# EAGLE design Primary_Board (EAGLE 9.3.2)
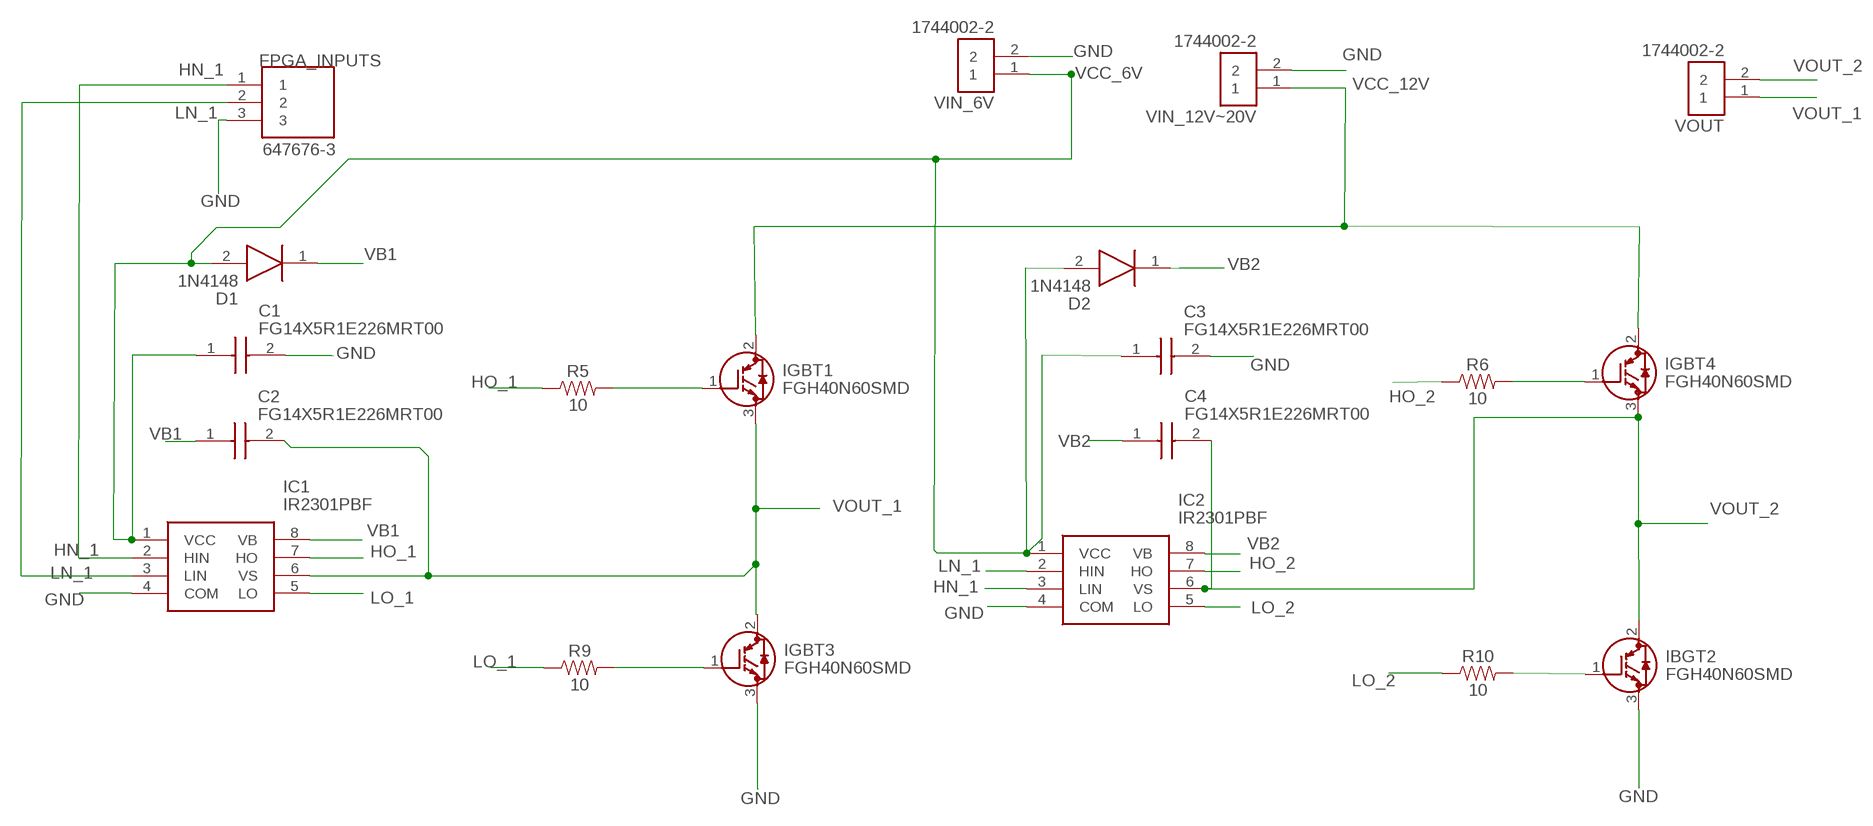
[diagram p0: schematic, sheet 1]

## Parts
C1  FG14X5R1E226MRT00  [CAPPRD550W50D395H550]
C2  FG14X5R1E226MRT00  [CAPPRD550W50D395H550]
C3  FG14X5R1E226MRT00  [CAPPRD550W50D395H550]
C4  FG14X5R1E226MRT00  [CAPPRD550W50D395H550]
D1  1N4148  [DIOAD1068W53L380D172]
D2  1N4148  [DIOAD1068W53L380D172]
FPGA_INPUTS  647676-3  [TE_647676-3]
IBGT2  FGH40N60SMD  [TO556P482X1562X2475-3P]
IC1  IR2301PBF  [DIP762W56P254L988H533Q8N]
IC2  IR2301PBF  [DIP762W56P254L988H533Q8N]
IGBT1  FGH40N60SMD  [TO556P482X1562X2475-3P]
IGBT3  FGH40N60SMD  [TO556P482X1562X2475-3P]
IGBT4  FGH40N60SMD  [TO556P482X1562X2475-3P]
R5  10  10OHM-HORIZ-1/4W-1%  [AXIAL-0.3]
R6  10  10OHM-HORIZ-1/4W-1%  [AXIAL-0.3]
R9  10  10OHM-HORIZ-1/4W-1%  [AXIAL-0.3]
R10  10  10OHM-HORIZ-1/4W-1%  [AXIAL-0.3]
VIN_6V  1744002-2  [CONN_1744002-2]
VIN_12V~20V  1744002-2  [CONN_1744002-2]
VOUT  1744002-2  [CONN_1744002-2]

## Nets
GND: C1.2(-) C3.2(-) FPGA_INPUTS.3 IBGT2.3(E) IC1.4(COM) IC2.4(COM) IGBT3.3(E) VIN_6V.2 VIN_12V~20V.2
HN_1: FPGA_INPUTS.1 IC1.2(HIN) IC2.3(LIN)
HO_1: IC1.7(HO) R5.P$1
HO_2: IC2.7(HO) R6.P$1
IGBT2: IBGT2.1(G) R10.P$2
LN_1: FPGA_INPUTS.2 IC1.3(LIN) IC2.2(HIN)
LO_1: IC1.5(LO) R9.P$1
LO_2: IC2.5(LO) R10.P$1
N$1: IGBT1.1(G) R5.P$2
N$2: IGBT4.1(G) R6.P$2
N$3: IGBT3.1(G) R9.P$2
VB1: C2.1(+) D1.1(K) IC1.8(VB)
VB2: C4.1(+) D2.1(K) IC2.8(VB)
VCC_6V: C1.1(+) C3.1(+) D1.2(A) D2.2(A) IC1.1(VCC) IC2.1(VCC) VIN_6V.1
VCC_12V: IGBT1.2(C) IGBT4.2(C) VIN_12V~20V.1
VOUT_1: C2.2(-) IC1.6(VS) IGBT1.3(E) IGBT3.2(C) VOUT.1
VOUT_2: C4.2(-) IBGT2.2(C) IC2.6(VS) IGBT4.3(E) VOUT.2

## Library data of the parts
C1-C4 = FG14X5R1E226MRT00:FG14X5R1E226MRT00: Multilayer Ceramic Capacitors MLCC - Leaded RAD 25V 22uF X5R 20% LS:2.5mm Source: Datasheet <https://mouser.componentsearchengine.com/Datasheets/1/FG14X5R1E226MRT00.pdf>; DESCRIPTION: Multilayer Ceramic Capacitors MLCC - Leaded RAD 25V 22uF X5R 20% LS:2.5mm; HEIGHT: 5.5mm; MANUFACTURER_NAME: TDK; MANUFACTURER_PART_NUMBER: FG14X5R1E226MRT00
D1 D2 = 1N4148:1N4148: 1N4148, Signal Diode, 400mA 100V, 2-Pin DO-35 Source: Datasheet <http://docs-emea.rs-online.com/webdocs/0d1d/0900766b80d1d11f.pdf>; DESCRIPTION: 1N4148, Signal Diode, 400mA 100V, 2-Pin DO-35; HEIGHT: mm; MANUFACTURER_NAME: Fairchild Semiconductor; MANUFACTURER_PART_NUMBER: 1N4148; MOUSER_PART_NUMBER: 512-1N4148; MOUSER_PRICE-STOCK: https://www.mouser.com/Search/Refine.aspx?Keyword=512-1N4148; RS_PART_NUMBER: 1698781; RS_PRICE-STOCK: http://uk.rs-online.com/web/p/products/1698781
FPGA_INPUTS = 647676-3:647676-3: 3.96 EP HDR ASSY 3P R/A; AVAILABILITY: Unavailable; CENTERLINE_PITCH: 3.96 mm[.156 in]; COMMENT: 647676-3; DESCRIPTION: 3.96 EP HDR ASSY 3P R/A; EU_ROHS_COMPLIANCE: Compliant; MF: TE Connectivity; MP: 647676-3; NUMBER_OF_POSITIONS: 3; PACKAGE: None; PRICE: None; PRODUCT_TYPE: Header; TE_PURCHASE_URL: https://www.te.com/usa-en/product-647676-3.html?te_bu=Cor&te_type=disp&te_campaign=seda_glo_cor-seda-global-disp-prtnr-fy19-seda-model-bom-cta_sma-317_1&elqCampaignId=32493
IBGT2 IGBT1 IGBT3 IGBT4 = FGH40N60SMD:FGH40N60SMD: 600V, 40A, 1.9V, TO-247 Field Stop IGBT Source: Datasheet <http://www.onsemi.com/pub/Collateral/FGH40N60SMD-D.PDF>; DESCRIPTION: 600V, 40A, 1.9V, TO-247 Field Stop IGBT; HEIGHT: 4.82mm; MANUFACTURER_NAME: ON Semiconductor; MANUFACTURER_PART_NUMBER: FGH40N60SMD; MOUSER_PART_NUMBER: 512-FGH40N60SMD; RS_PART_NUMBER: 1241336; RS_PRICE-STOCK: http://uk.rs-online.com/web/p/products/1241336
IC1 IC2 = IR2301PBF:IR2301PBF: High&Low Side MOSFET Driver 350mA PDIP8 Infineon IR2301PBF, Dual MOSFET Power Driver 350mA, 5 20 V, Non-Inverting, 8-Pin PDIP Source: Datasheet <https://www.infineon.com/dgdl/ir2301.pdf?fileId=5546d462533600a4015355c97bb216dc>; ALLIED_NUMBER: 70018142; ALLIED_PRICE-STOCK: https://www.alliedelec.com/infineon-ir2301pbf/70018142/; DESCRIPTION: High&Low Side MOSFET Driver 350mA PDIP8 Infineon IR2301PBF, Dual MOSFET Power Driver 350mA, 5 20 V, Non-Inverting, 8-Pin PDIP; HEIGHT: 5.33mm; MANUFACTURER_NAME: Infineon; MANUFACTURER_PART_NUMBER: IR2301PBF; MOUSER_PART_NUMBER: 942-IR2301PBF; MOUSER_PRICE-STOCK: https://www.mouser.com/Search/Refine.aspx?Keyword=942-IR2301PBF; RS_PART_NUMBER: 8655724P; RS_PRICE-STOCK: http://uk.rs-online.com/web/p/products/8655724P
R5 R6 R9 R10 = SparkFun-Resistors:10OHM: 10Ω resistor A resistor is a passive two-terminal electrical component that implements electrical resistance as a circuit element. Resistors act to reduce current flow, and, at the same time, act to lower voltage levels within circuits. - Wikipedia; PROD_ID: RES-12180
VIN_6V VIN_12V~20V VOUT = 1744002-2:1744002-2: CONN HEADER VERT 2POS 3.96MM; AVAILABILITY: Unavailable; DESCRIPTION: CONN HEADER VERT 2POS 3.96MM; MF: TE Connectivity; MP: 1744002-2; PACKAGE: None; PRICE: None

## Board
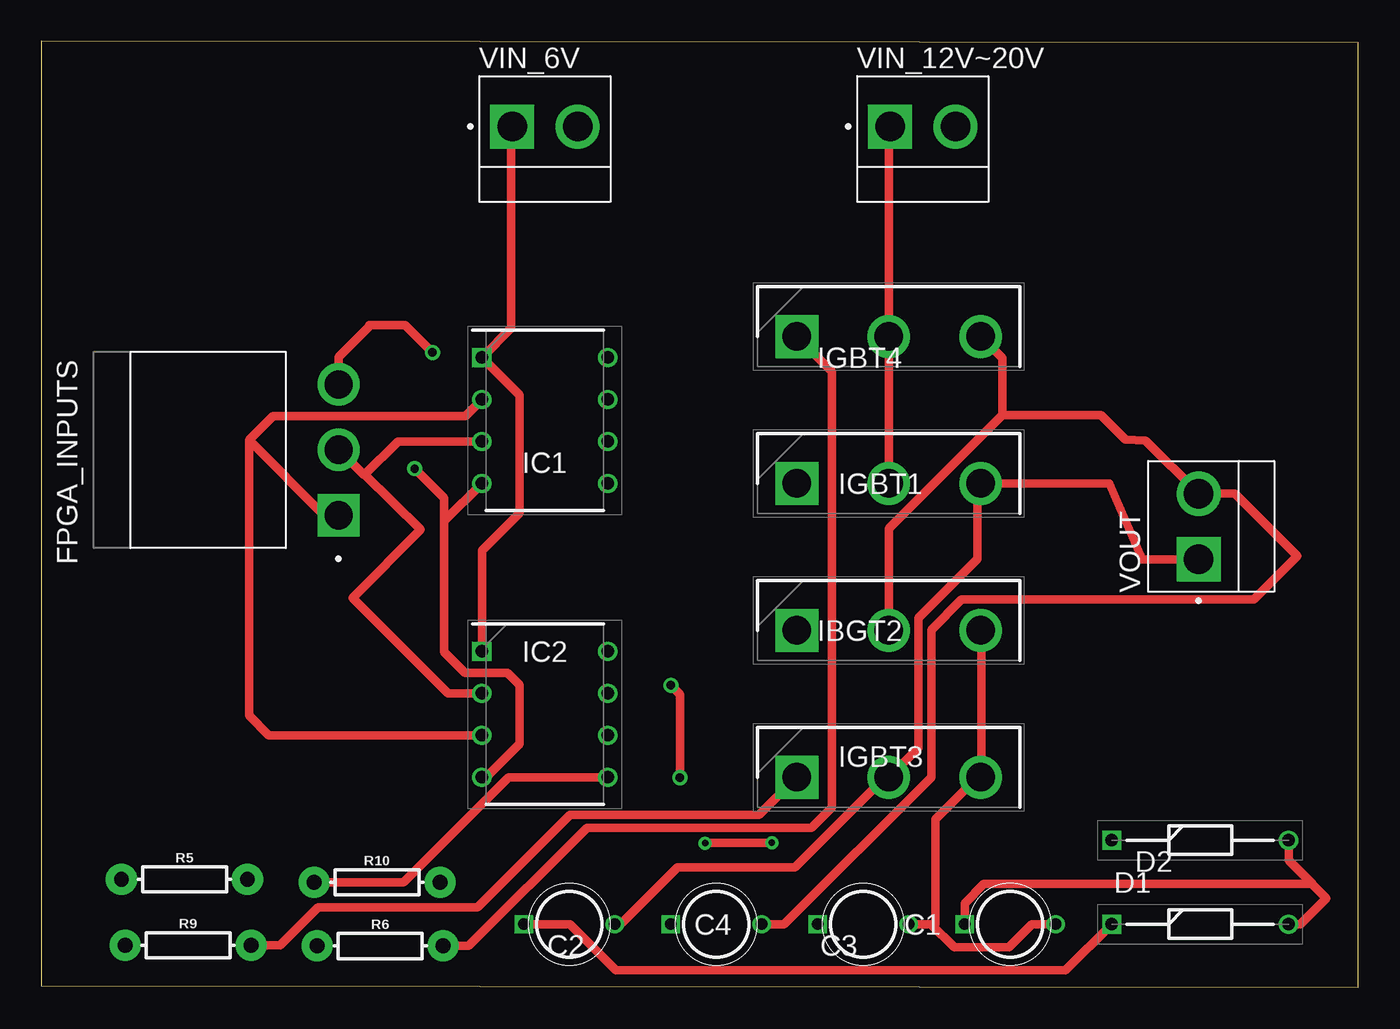
[diagram p1: board, top side]
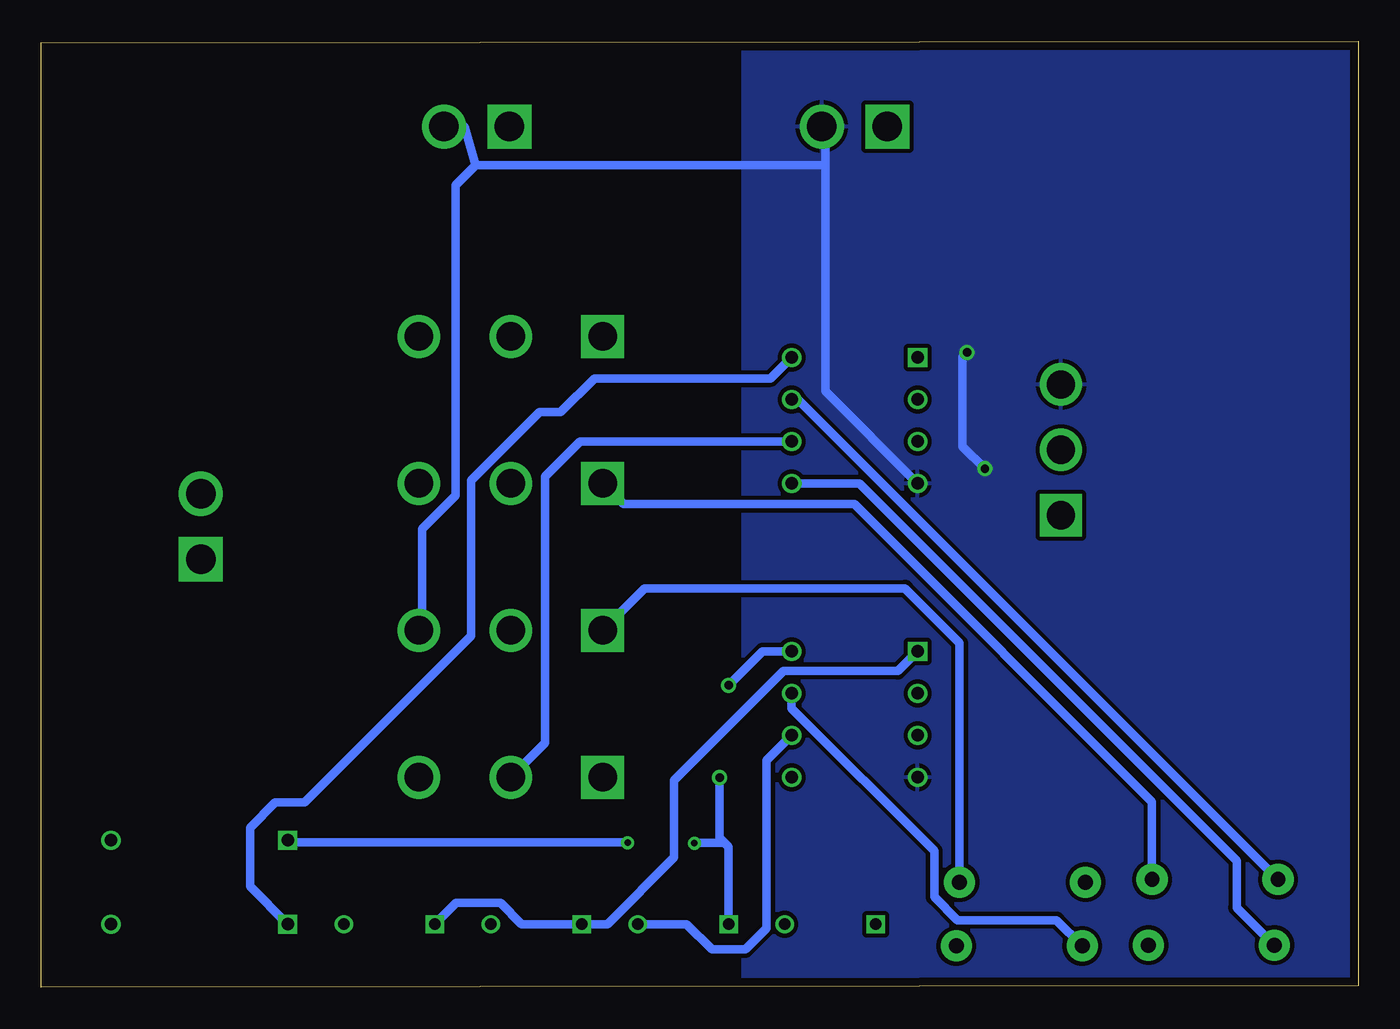
[diagram p2: board, bottom side, seen from below]

Size 79.66 x 57.23 mm. Coordinates in mm from the lower left corner, seen from the top.
Outline: 0,0.09 79.66,0 79.66,57.14 0,57.23 0,0.09
Copper layers (1*16): Top 0.035mm / dielectric 1.5mm / Bottom 0.035mm
Design rules "Standard": minimum track width 10mil, minimum drill 15mil, track to track 10mil, track to pad 10mil, pad to pad 10mil, via to via 10mil, smd to smd 10mil, copper to edge 20mil, drill to drill 10mil, minimum pad ring 8mil, minimum via ring 8mil, stop-mask expansion 4mil, vias tented up to drill 0mil, thermal gap 10mil

### Footprints (pad centres in the part's own frame; a part is rotated, then mirrored left to right if it is on the bottom)
CAPPRD550W50D395H550 = drill 0.7 pad 1.1 square: 1 0,0 | drill 0.7 pad 1.1: 2 5.5,0
DIOAD1068W53L380D172 = drill 0.75 pad 1.15 square: 1 0,0 | drill 0.75 pad 1.15: 2 10.7,0
TE_647676-3 = drill 1.7 square: 1 0,0 | drill 1.7: 2 3.96,0; 3 7.92,0
TO556P482X1562X2475-3P = drill 1.73 pad 2.595 square: 1 0,0 | drill 1.73 pad 2.595: 2 5.56,0; 3 11.12,0
DIP762W56P254L988H533Q8N = drill 0.758 pad 1.158 square: 1 -3.81,3.81 | drill 0.758 pad 1.158: 2 -3.81,1.27; 3 -3.81,-1.27; 4 -3.81,-3.81; 5 3.81,-3.81; 6 3.81,-1.27; 7 3.81,1.27; 8 3.81,3.81
AXIAL-0.3 = drill 0.9 pad 1.88: P$1 -3.81,0; P$2 3.81,0
CONN_1744002-2 = drill 1.78 square: 1 -1.983,0 | drill 1.78: 2 1.983,0

### Placement (x,y rotation side)
C1  55.86,3.81 0 top
C2  29.19,3.81 0 top
C3  46.97,3.81 0 top
C4  38.08,3.81 0 top
D1  64.75,3.81 0 top
D2  64.75,8.89 0 top
FPGA_INPUTS  17.98,28.55 90 top
IBGT2  45.7,21.59 0 top
IC1  30.46,34.29 0 top
IC2  30.46,16.51 0 top
IGBT1  45.7,30.48 0 top
IGBT3  45.7,12.7 0 top
IGBT4  45.7,39.37 0 top
R5  8.66,6.52 0 top
R6  20.5,2.5 0 top
R9  8.87,2.54 0 top
R10  20.3,6.35 0 top
VIN_6V  30.46,52.07 0 top
VIN_12V~20V  53.32,52.07 0 top
VOUT  70.01,27.88 90 top

### Tracks (layer width: path | path; a pad name or v marks a point on that pad's centre or on a via)
GND  (via drill 0.51)
  Top 0.254: 56.63,12.7 IGBT3.3 56.88,12.7 | 56.88,21.59 IBGT2.3
  Top 0.508: 53.83,3.81 54.09,3.81 54.09,10.16 56.63,12.7 | 53.83,3.81 C3.2 | 53.83,3.81 55.22,2.41 58.53,2.41 59.93,3.81 C1.2 | 56.88,12.7 56.88,21.59 | IC2.4 26.91,12.7 28.94,14.73 28.94,18.29 28.2,19.03 25.63,19.03 24.37,20.29 24.37,28.19 | IC1.4 24.37,28.19 | FPGA_INPUTS.3 17.98,38.13 19.88,40.03 19.84,40.07 22,40.07 v23.66,38.41 | 24.37,28.19 24.37,29.59 v22.58,31.38
  Bottom 0.254: 32.24,52.07 VIN_6V.2 | 56.63,21.59 IBGT2.3
  Bottom 0.508: 32.24,49.73 32.24,36.07 IC1.4 | 32.24,49.73 32.24,52.07 | VIN_12V~20V.2 54.05,52.07 53.38,49.73 | 32.24,49.73 53.38,49.73 | 56.63,21.59 56.63,27.72 54.59,29.75 54.59,48.51 53.38,49.73 | v23.66,38.41 23.93,38.14 23.93,32.73 v22.58,31.38
  pour Bottom: 37.22,57.25 37.22,57.03 37.22,0.08 35.12,0.08 -0.26,0.08 -0.26,0.53 0.12,57.25 3.95,57.25
HN_1
  Top 0.254: FPGA_INPUTS.1 17.11,28.55 12.57,33.1
  Top 0.508: IC2.3 13.77,15.24 12.57,16.44 12.57,33.1 | IC1.2 25.66,34.57 14.04,34.57 12.57,33.1 | FPGA_INPUTS.1 17.11,28.55 12.57,33.1
HO_1
  Bottom 0.508: IC1.7 33.89,35.56 R5.P$1
HO_2
  Bottom 0.508: IC2.7 34.27,16.88 25.64,8.25 25.64,5.46 24.24,4.06 18.26,4.06 R6.P$1
IGBT2
  Bottom 0.508: R10.P$2 24.11,20.83 27.42,24.13 43.16,24.13 IBGT2.1
LN_1
  Top 0.508: IC2.2 24.6,17.78 18.82,23.56 22.95,27.68 19.56,31.01 | IC1.3 21.57,33.02 19.56,31.01 | 19.56,31.01 19.54,30.98 FPGA_INPUTS.2
LO_1
  Bottom 0.508: IC1.5 30.16,30.48 7.34,7.66 7.34,4.82 R9.P$1
LO_2
  Top 0.508: IC2.5 28.28,12.7 21.93,6.35 R10.P$1
N$1
  Bottom 0.508: R5.P$2 12.47,11.21 30.48,29.23 44.45,29.23 IGBT1.1
N$2
  Top 0.508: R6.P$2 25.84,2.5 33,9.65 46.6,9.65 47.83,10.88 47.83,37.25 IGBT4.1
N$3
  Top 0.508: R9.P$2 14.46,2.54 16.75,4.83 26.4,4.83 31.99,10.41 43.42,10.41 IGBT3.1
VB1
  Top 0.508: C2.1 31.99,3.81 34.78,1.02 61.96,1.02 D1.1
  Bottom 0.508: IC1.8 35.54,36.83 46.21,36.83 48.24,34.8 49.51,34.8 53.67,30.64 53.67,21.25 63.74,11.18 65.52,11.18 67.04,9.65 67.04,6.1 D1.1
VB2  (via drill 0.38, 0.51)
  Top 0.254: 40.19,8.75 arc90 v40.16,8.72
  Top 0.508: v38.63,12.69 38.63,17.72 v38.08,18.27 | v44.19,8.75 40.19,8.75
  Bottom 0.254: v40.16,8.72 40.12,8.67 | 44.22,8.78 arc90 v44.19,8.75
  Bottom 0.508: C4.1 38.08,8.49 38.33,8.73 | v38.63,12.69 38.63,9.03 38.33,8.73 | 38.33,8.73 40.06,8.73 40.12,8.67 | D2.1 64.64,8.78 44.22,8.78 | IC2.8 36.03,20.32 v38.08,18.27
VCC_6V
  Top 0.254: 28.43,52.07 VIN_6V.1
  Top 0.508: 76.12,7 76.87,6.25 57.03,6.25 55.86,5.08 C1.1 | 76.12,7 77.73,5.39 76.15,3.81 D1.2 | 76.12,7 75.45,7.67 D2.2 | IC2.1 26.65,26.42 28.94,28.7 28.94,35.81 IC1.1 28.43,39.88 28.43,52.07
  Bottom 0.508: C1.1 54.58,5.1 51.89,5.1 50.61,3.81 C3.1 45.43,3.81 41.39,7.85 41.39,12.52 34.78,19.12 27.85,19.12 IC2.1
VCC_12V
  Top 0.254: 51.29,30.48 IGBT1.2 | 51.29,52.07 VIN_12V~20V.1 | 51.29,39.37 IGBT4.2
  Top 0.508: 51.29,30.48 51.29,39.37 51.29,52.07
VOUT_1
  Top 0.254: 51.04,12.7 IGBT3.2 51.29,12.7 | 56.63,30.48 IGBT1.3
  Top 0.508: IGBT1.3 64.61,30.48 66.6,25.89 VOUT.1 | C2.2 35.04,3.81 38.47,7.25 45.58,7.25 51.04,12.7 | 56.63,30.48 56.63,25.91 53.07,22.35 53.07,14.48 51.29,12.7
  Bottom 0.508: IC1.6 47.07,33.02 49.19,30.9 49.19,14.77 IGBT3.2
VOUT_2
  Top 0.254: 51.29,21.59 IBGT2.2
  Top 0.508: 51.29,21.59 51.29,27.77 58.13,34.61 | IGBT4.3 58.13,38.06 58.13,34.61 | 58.13,34.61 64.11,34.61 65.58,33.13 66.8,33.07 VOUT.2 72.2,29.86 75.97,26.09 73.34,23.46 55.67,23.46 53.83,21.62 53.83,12.7 44.94,3.81 C4.2
  Bottom 0.508: C4.2 40.62,3.81 39.1,2.29 37.07,2.29 35.8,3.56 35.8,13.72 IC2.6